# Altium schematic sheet 01-POWER.SchDoc
size B
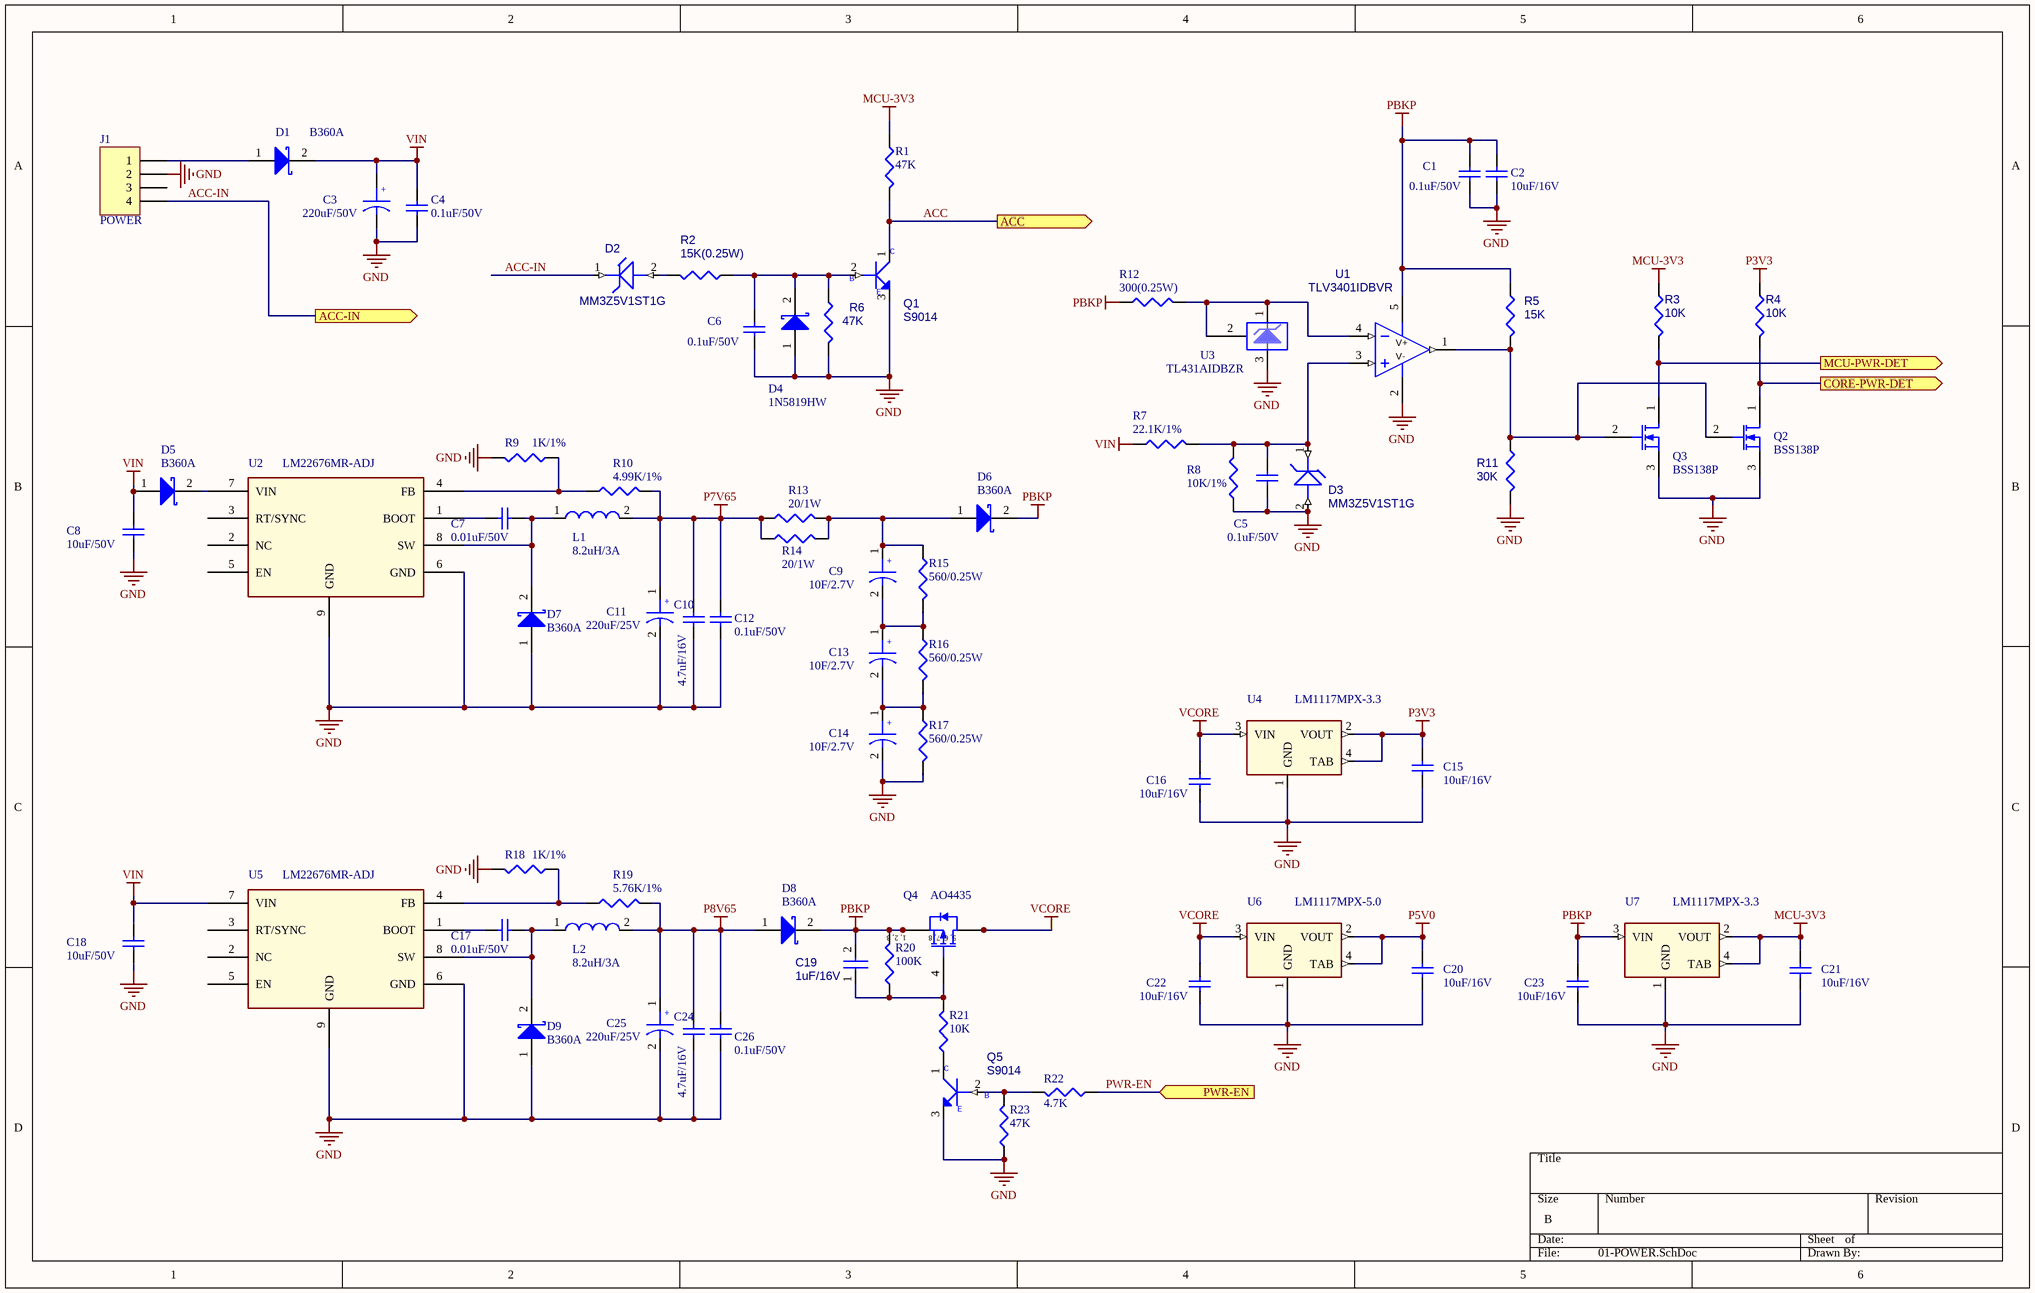
[diagram p0: 01-POWER.SchDoc]

## Parts
C1  0.1uF/50V  [0402]
C2  10uF/16V  [0805]
C3  220uF/50V  [DL-10*10.5]
C4  0.1uF/50V  [0402]
C5  0.1uF/50V  [0402]
C6  0.1uF/50V  [0402]
C7  0.01uF/50V  [0402]
C8  10uF/50V  [1210]
C9  10F/2.7V  [SUPERCAP]
C10  4.7uF/16V  [0805]
C11  220uF/25V  [DL-8*10.5]
C12  0.1uF/50V  [0402]
C13  10F/2.7V  [SUPERCAP]
C14  10F/2.7V  [SUPERCAP]
C15  10uF/16V  [0805]
C16  10uF/16V  [0805]
C17  0.01uF/50V  [0402]
C18  10uF/50V  [1210]
C19  1uF/16V  [0603]
C20  10uF/16V  [0805]
C21  10uF/16V  [0805]
C22  10uF/16V  [0805]
C23  10uF/16V  [0805]
C24  4.7uF/16V  [0805]
C25  220uF/25V  [DL-8*10.5]
C26  0.1uF/50V  [0402]
D1  B360A  [B320A]
D2  MM3Z5V1ST1G  [SOD323F]
D3  MM3Z5V1ST1G  [SOD323F]
D4  1N5819HW  [1N5819]
D5  B360A  [B320A]
D6  B360A  [B320A]
D7  B360A  [B320A]
D8  B360A  [B320A]
D9  B360A  [B320A]
J1  POWER  [3030WV-F-2*2P]
L1  8.2uH/3A  [IND_10X10]
L2  8.2uH/3A  [IND_10X10]
Q1  S9014  [NPN]
Q2  BSS138P  [NPN]
Q3  BSS138P  [NPN]
Q4  AO4435  [SO8]
Q5  S9014  [NPN]
R1  47K  [0402]
R2  15K(0.25W)  [1206]
R3  10K  [0402]
R4  10K  [0402]
R5  15K  [0402]
R6  47K  [0402]
R7  22.1K/1%  [0402]
R8  10K/1%  [0402]
R9  1K/1%  [0402]
R10  4.99K/1%  [0402]
R11  30K  [0402]
R12  300(0.25W)  [1206]
R13  20/1W  [2512]
R14  20/1W  [2512]
R15  560/0.25W  [1206]
R16  560/0.25W  [1206]
R17  560/0.25W  [1206]
R18  1K/1%  [0402]
R19  5.76K/1%  [0402]
R20  100K  [0402]
R21  10K  [0402]
R22  4.7K  [0402]
R23  47K  [0402]
U1  TLV3401IDBVR  [SOT23-5]
U2  LM22676MR-ADJ  [PSO8]
U3  TL431AIDBZR  [SOT23-3]
U4  LM1117MPX-3.3  [AMS1117]
U5  LM22676MR-ADJ  [PSO8]
U6  LM1117MPX-5.0  [AMS1117]
U7  LM1117MPX-3.3  [AMS1117]

## Ports
ACC (out), ACC-IN (out), CORE-PWR-DET (out), MCU-PWR-DET (out), PWR-EN (in)

## Nets
GND: C1.2 C2.1 C3.2 C4.1 C5.1 C6.2 C8.2 C10.1 C11.2 C12.1 C14.2 C15.2 C16.2 C18.2 C20.2 C21.2 C22.2 C23.2 C24.1 C25.2 C26.1 D3.2 D4.1(A) D7.1(A) D9.1(A) J1.2 Q1.3(EMITTER) Q2.3(S) Q3.3(S) Q5.3(EMITTER) R6.2 R8.1 R9.2 R11.2 R17.2 R18.2 R23.1 U1.2(V-) U2.6(GND) U2.9(GND) U3.3(A) U4.1(GND) U5.6(GND) U5.9(GND) U6.1(GND) U7.1(GND)
MCU-3V3: C21.1 R1.1 R3.1 U7.2(VOUT) U7.4(TAB)
P3V3: C15.1 R4.1 U4.2(VOUT) U4.4(TAB)
P5V0: C20.1 U6.2(VOUT) U6.4(TAB)
P7V65: C10.2 C11.1 C12.2 L1.2 R10.2 R13.1 R14.1
P8V65: C24.2 C25.1 C26.2 D8.1(A) L2.2 R19.2
PBKP: C1.1 C2.2 C19.2 C23.1 D6.2(K) D8.2(K) Q4.1(S) Q4.2(S) Q4.3(S) R5.1 R12.1 R20.2 U1.5(V+) U7.3(VIN)
VCORE: C16.1 C22.1 Q4.5(D) Q4.6(D) Q4.7(D) Q4.8(D) U4.3(VIN) U6.3(VIN)
VIN: C3.1 C4.2 C8.1 C18.1 D1.2(K) D5.1(A) R7.1 U5.7(VIN)
ACC: Q1.1(COLLECTOR) R1.2 ; port ACC
ACC-IN: D2.1 J1.4 ; port ACC-IN
CORE-PWR-DET: Q2.1(D) R4.2 ; port CORE-PWR-DET
MCU-PWR-DET: Q3.1(D) R3.2 ; port MCU-PWR-DET
PWR-EN: R22.1 ; port PWR-EN
NetC5_2: C5.2 D3.1 R7.2 R8.2 U1.3(IN+)
NetC6_1: C6.1 D4.2(K) Q1.2(BASE) R2.1 R6.1
NetC7_1: C7.1 D7.2(K) L1.1 U2.8(SW)
NetC7_2: C7.2 U2.1(BOOT)
NetC9_1: C9.1 D6.1(A) R13.2 R14.2 R15.1
NetC9_2: C9.2 C13.1 R15.2 R16.1
NetC13_2: C13.2 C14.1 R16.2 R17.1
NetC17_1: C17.1 D9.2(K) L2.1 U5.8(SW)
NetC17_2: C17.2 U5.1(BOOT)
NetC19_1: C19.1 Q4.4(G) R20.1 R21.2
NetD1_1: D1.1(A) J1.1
NetD2_2: D2.2 R2.2
NetD5_2: D5.2(K) U2.7(VIN)
NetQ2_2: Q2.2(G) Q3.2(G) R5.2 R11.1 U1.1(OUT)
NetQ5_1: Q5.1(COLLECTOR) R21.1
NetQ5_2: Q5.2(BASE) R22.2 R23.2
NetR9_1: R9.1 R10.1 U2.4(FB)
NetR12_2: R12.2 U1.4(IN-) U3.1(K) U3.2(REF)
NetR18_1: R18.1 R19.1 U5.4(FB)

Not connected (* = marked no-connect by the designer): J1 3; U2 2(NC) 3(RT/SYNC) 5(EN); U5 2(NC) 3(RT/SYNC) 5(EN)

## Notes on the sheet
- (in symbol CAP WP) +
- (in symbol MMBT3904_NL_SOT23-3) C; B; E
- (in symbol SI4431DY) 1, 2, 3; 5, 6, 7, 8

## Library data of the parts
C1 C2 C6 C8 C15 C16 C18 C20-C23 = Cap: Capacitor; Published: 8-Jun-2000; LatestRevisionDate: 17-Jul-2002; LatestRevisionNote: Re-released for DXP Platform.; PackageReference: RAD-0.3; Publisher: Altium Limited; PackageDescription: Radial Cap, Thru-Hole; 2 Leads; 0.3 in Pin Spacing
C3 C9 C11 C13 C14 C25 = CAP WP
C4 C5 C7 C10 C12 C17 C24 C26 = Cap: Capacitor; Value: 0.1uF; Published: 8-Jun-2000; LatestRevisionDate: 17-Jul-2002; LatestRevisionNote: Re-released for DXP Platform.; PackageReference: RAD-0.3; Publisher: Altium Limited; PackageDescription: Radial Cap, Thru-Hole; 2 Leads; 0.3 in Pin Spacing
C19 = CAP NP_Dup2
D1 D4-D9 = Diode 11DQ03: Schottky Rectifier
D2 D3 = MMGZ5231BPTLL34
J1 = Header 4: Header, 4-Pin; LatestRevisionDate: 17-Jul-2002; LatestRevisionNote: Re-released for DXP Platform.; Publisher: Altium Limited
L1 L2 = 4.7UH_CDH2D09BNP-4R7MC_0.7A_20%: Part Number: SH00000AJ00; ROOM: +1.3V_CORE
Q1 Q5 = MMBT3904_NL_SOT23-3: Part Description: S TR MMBT3904_NL NPN SOT23; Part Number: SB039040000
Q2 Q3 = MOSFET-N: N-Channel MOSFET; Published: 8-Jun-2000; LatestRevisionDate: 17-Jul-2002; LatestRevisionNote: Re-released for DXP Platform.; PackageVersion: 1995/1996; PackageReference: E3; Publisher: Altium Limited; PackageDescription: TO, Flat Index; 3 In-Line, Axial Leads; Body Dia. 4.6mm; Lead Dia. 0.5 mm (max)
Q4 = SI4431DY: P-Channel 30V (D-S)  MOSFET; Published: 8-Jun-2000; LatestRevisionDate: 13-Apr-2006; LatestRevisionNote: IPC-7351 Footprint Added.; DatasheetVersion: 6-Oct-1997; PackageVersion: Aug-1998; PackageReference: SO-8; Publisher: Altium Limited; PackageDescription: 8-Pin Small Outline Integrated Circuit 1.27 mm Pitch; ComponentLink1Description: Manufacturer Link; ComponentLink1URL: http://www.vishay.com/; ComponentLink2Description: Datasheet; ComponentLink2URL: http://www.vishay.com/docs/70151/70151.pdf
R1 R7 R8 R12 R20-R23 = CR16-1003FM
R2-R6 R11 = R
R9 R10 R13-R19 = Res3: Resistor; Value: 1K; Published: 8-Jun-2000; LatestRevisionDate: 29-May-2009; LatestRevisionNote: IPC-7351 Footprint Added.; PackageReference: J1-0603; Publisher: Altium Limited; PackageDescription: Chip Resistor
U1 = LM7321MF: Single 30V High Output Current and Unlimited Capacitive Load Op Amp; Manufacturer: National Semiconductor; Characteristics: LM7321MF Single 30V High Output Current and Unlimited Capacitive Load Op Amp; CompType: OpAmp IC; TaMin_C: -40.0; TaMax_C: 125.0; PowerWise: Y; SymbolVersion: 2008-07-09; PartNumber: LM7321MF; Value: LM7321MF; PackageDescription: 5 Lead SOT-23; PackageReference: MF05A_L; MountType: SMT; RoHS: O; ComponentLink1Description: LM7321 Datasheet; ComponentLink1URL: http://www.ti.com/lit/gpn/LM7321; ComponentLink2Description: LM7321 Web Page; ComponentLink2URL: http://www.ti.com/product/LM7321; ComponentLink3Description: MF05A Package Web Page; ComponentLink3URL: http://www.national.com/packaging/folders/mf05a.html; Version: B1.743; LatestRevisionDate: 2012-11-01; LatestRevisionNote: Mass Update; Publisher: National Semiconductor; Published: 2012-11-01
U2 U5 = LM22670_0
U4 U6 U7 = LD1117AS18: IC VREG LDO 1.8V 1A 10V SOT-223; CAD_APPROVED: Yes; MFG_PN01: LD1117AS18TR; MFG_NAME01: ST MICROELECTRONICS; AGILE_PN: 315-78911; CLASS: IC; HEIGHT: 1.9MM; ROHS: Yes